# Altium schematic sheet USB_interface.SchDoc: USB interface
size 420 x 297 mm; CheckedBy: T.Janicki; CompanyName: Creotech Instruments SA; DrawnBy: G. Kasprowicz; Organization: CERN; Address1: European Organization for Nuclear Research; Address2: CH-1211 Geneve 23 - Switzerland; DocumentNumber: 10; Revision: -; SheetNumber: 17; SheetTotal: 21; EDA_Number: EDA-xxxx; Projet: Simple VME FMC Carrier; CreateDate: 20/11/2012; CheckedDate: 30/04/2012; DivGrp: BE-CO; Designer: G.Kasprowicz; DocumentName: USB.SchDoc; ModifiedDate: -; Rule: PcbType=ProtelPcb
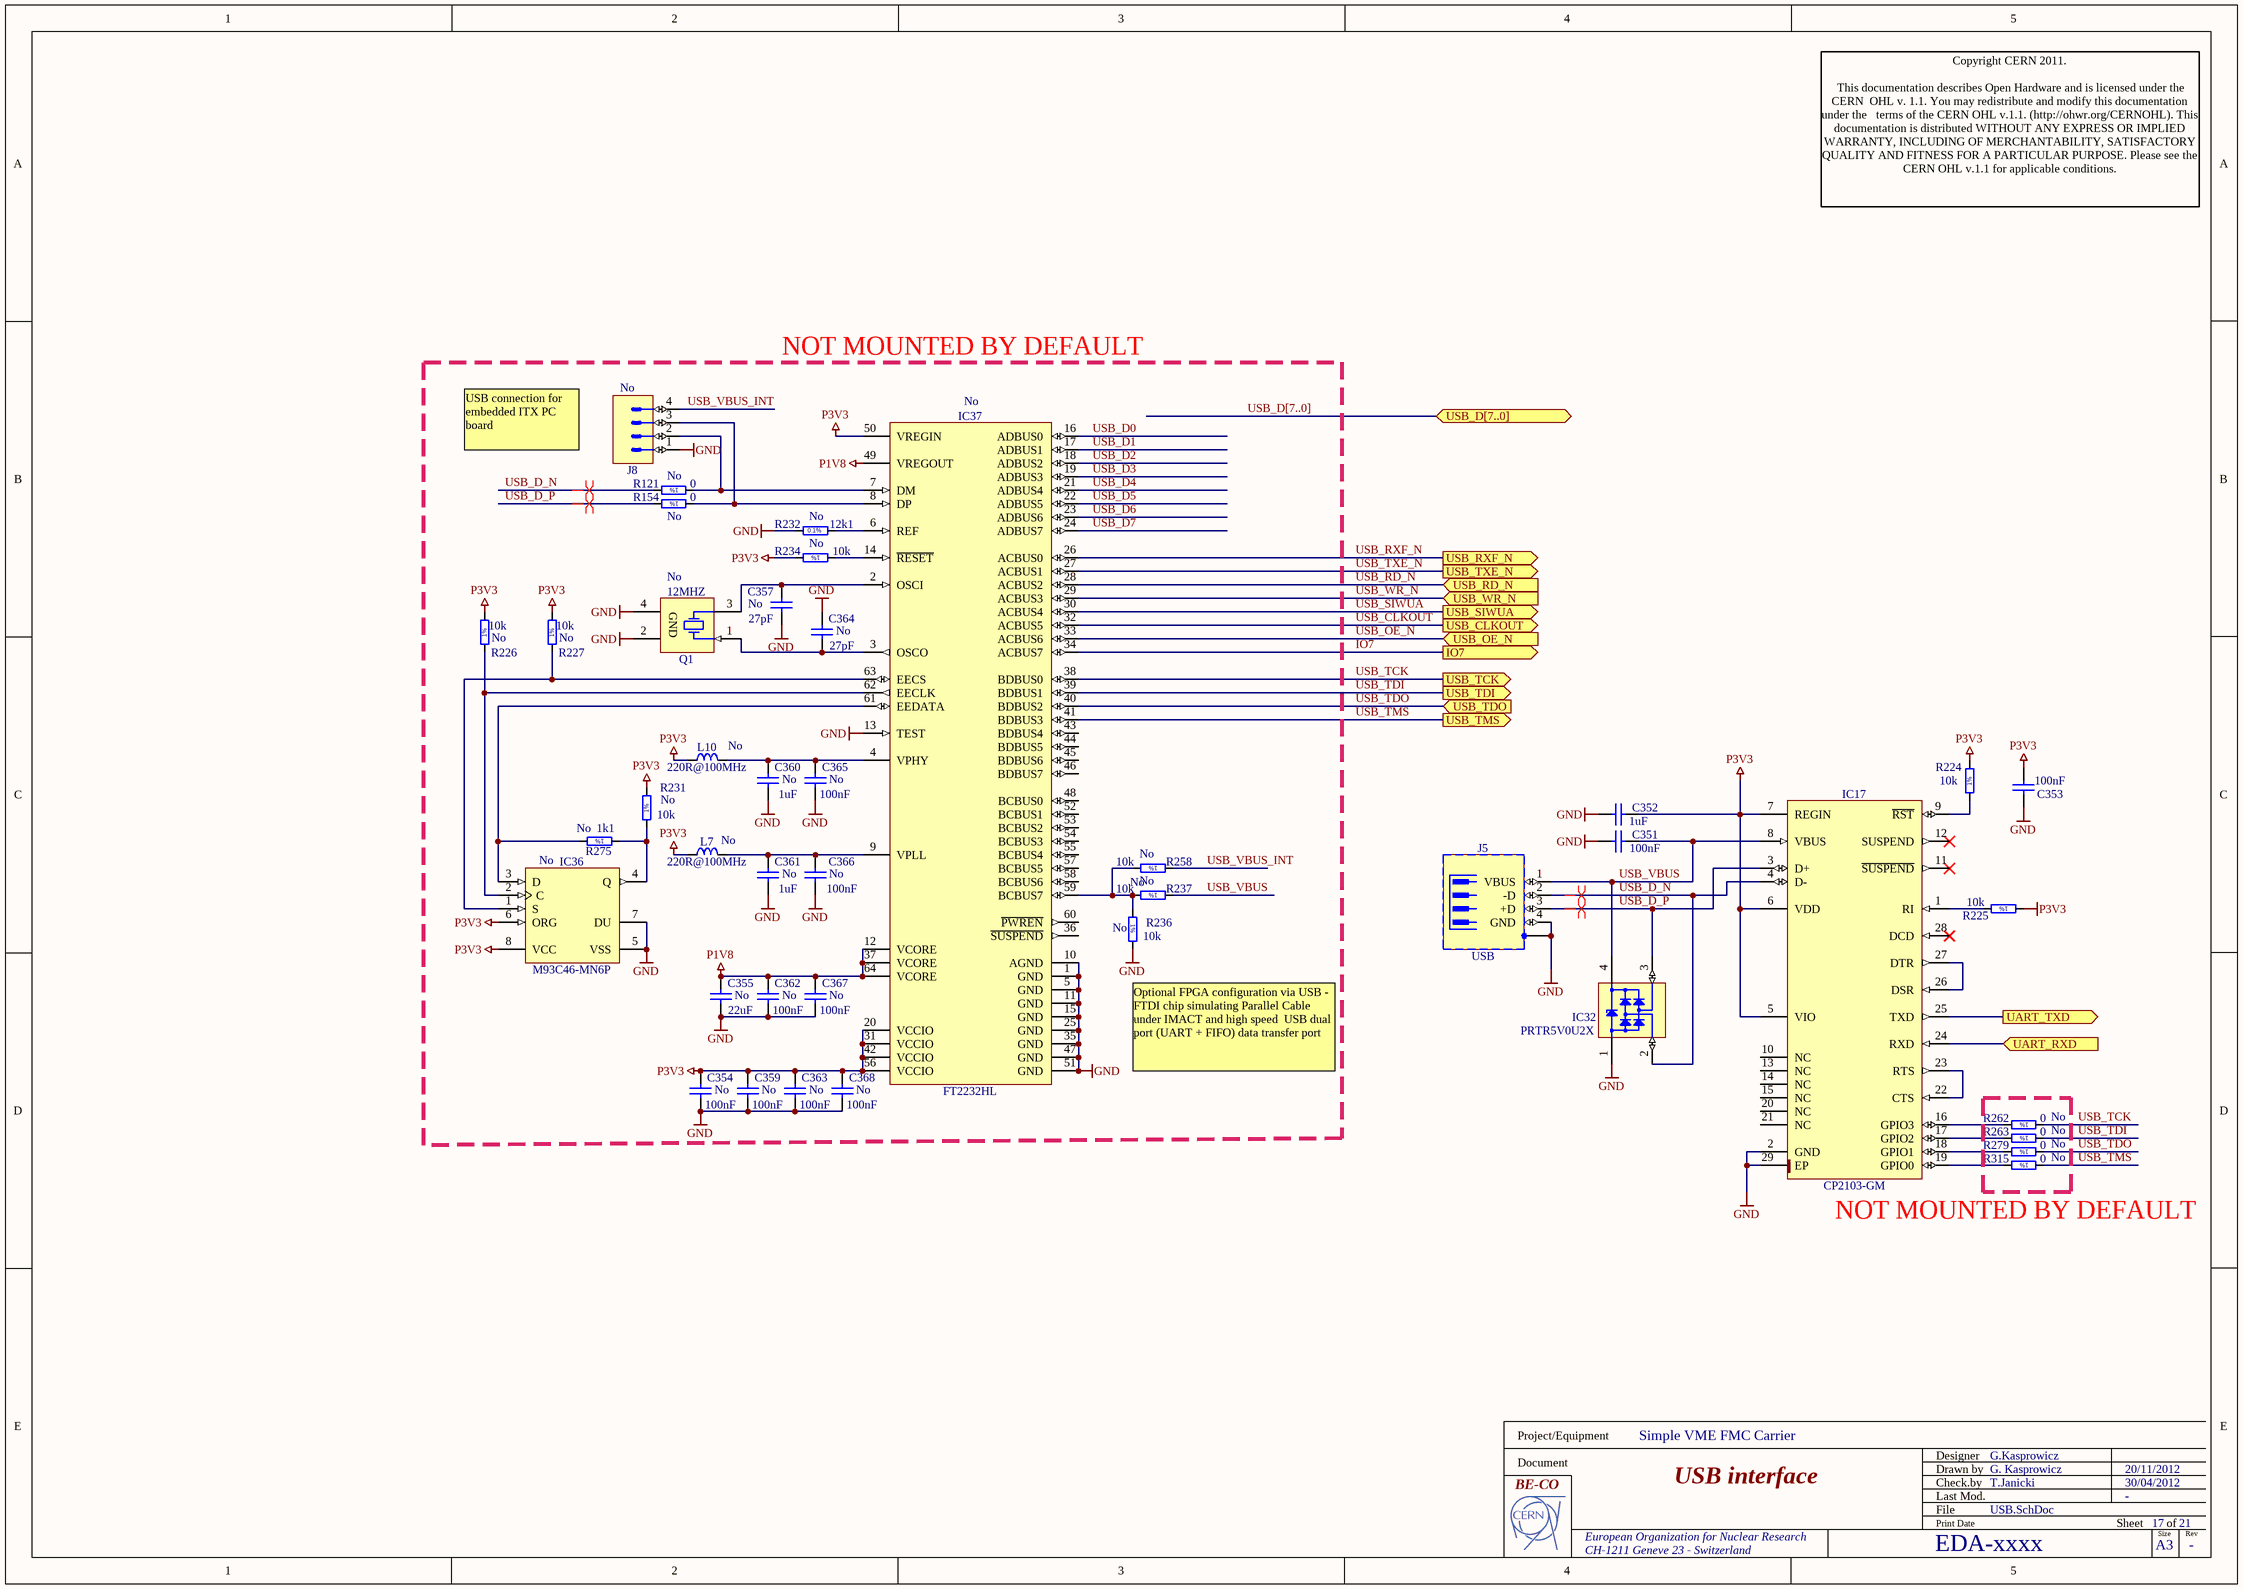
[diagram p0: USB_interface.SchDoc]

## Parts
C351  100nF  [CAPC1005X55N]
C352  1uF  [CAPC1608X87N]
C353  100nF  [CAPC1005X55N]
C354  100nF  Mounted: No  [CAPC1005X55N]
C355  22uF  Mounted: No  [CAPC3216X180N]
C357  27pF  Mounted: No  [CAPC1608X87N]
C359  100nF  Mounted: No  [CAPC1005X55N]
C360  1uF  Mounted: No  [CAPC1608X87N]
C361  1uF  Mounted: No  [CAPC1608X87N]
C362  100nF  Mounted: No  [CAPC1005X55N]
C363  100nF  Mounted: No  [CAPC1005X55N]
C364  27pF  Mounted: No  [CAPC1608X87N]
C365  100nF  Mounted: No  [CAPC1005X55N]
C366  100nF  Mounted: No  [CAPC1005X55N]
C367  100nF  Mounted: No  [CAPC1005X55N]
C368  100nF  Mounted: No  [CAPC1005X55N]
IC17  CP2103-GM  [QFN50P500X500X100-29N-S335]
IC32  PRTR5V0U2X  [SOT190P230X110-4N]
IC36  M93C46-MN6P  Mounted: No  [SOIC127P600X175-8N]
IC37  FT2232HL  Mounted: No  [QFP50P1200X1200X160-64N]
J5  USB  [TYCO_292304-1]
J8  Mounted: No  [MOLEX_22-04-1041]  (hidden comment: KK®)
L7  220R@100MHz  Mounted: No  [INDC2012X105N]
L10  220R@100MHz  Mounted: No  [INDC2012X105N]
Q1  12MHZ  Mounted: No  [XTAL_ABRACON_ABM3B]
R121  0  Mounted: No  [RESC1608X55N]
R154  0  Mounted: No  [RESC1608X55N]
R224  10k  [RESC1608X55N]
R225  10k  [RESC1608X55N]
R226  10k  Mounted: No  [RESC1608X55N]
R227  10k  Mounted: No  [RESC1608X55N]
R231  10k  Mounted: No  [RESC1608X55N]
R232  12k1  Mounted: No  [RESC1608X55N]
R234  10k  Mounted: No  [RESC1608X55N]
R236  10k  Mounted: No  [RESC1608X55N]
R237  10k  Mounted: No  Socket: No  [RESC1608X55N]
R258  10k  Mounted: No  [RESC1608X55N]
R262  0  Mounted: No  [RESC1608X55N]
R263  0  Mounted: No  [RESC1608X55N]
R275  1k1  Mounted: No  [RESC1608X55N]
R279  0  Mounted: No  [RESC1608X55N]
R315  0  Mounted: No  [RESC1608X55N]

## Blocks framed on the sheet
NOT MOUNTED BY DEFAULT: C354 C355 C357 C359-C368 IC36 IC37 J8 L7 L10 Q1 R121 R154 R226 R227 R231 R232 R234 R236 R237 R258 R275

## Ports
IO7 (out), UART_RXD (in), UART_TXD (out), USB_CLKOUT (out), USB_D[7..0] (bidir), USB_OE_N (in), USB_RD_N (in), USB_RXF_N (out), USB_SIWUA (out), USB_TCK (out), USB_TDI (out), USB_TDO (in), USB_TMS (out), USB_TXE_N (out), USB_WR_N (in)

## Nets
GND: C351.2 C352.2 C353.2 C354.2 C355.1 C357.1 C359.2 C360.1 C361.1 C362.2 C363.2 C364.1 C365.2 C366.2 C367.2 C368.2 IC17.2(GND) IC17.29(EP) IC32.1(GND) IC36.5(VSS) IC36.7(DU) IC37.1(GND) IC37.5(GND) IC37.10(AGND) IC37.11(GND) IC37.13(TEST) IC37.15(GND) IC37.25(GND) IC37.35(GND) IC37.47(GND) IC37.51(GND) J5.4(GND) J5.5(SH) J8.1 Q1.2(GND) Q1.4(GND) R232.1 R236.2
P1V8: C355.2 C362.1 C367.1 IC37.12(VCORE) IC37.37(VCORE) IC37.49(VREGOUT) IC37.64(VCORE)
P3V3: C352.1 C353.1 C354.1 C359.1 C363.1 C368.1 IC17.5(VIO) IC17.6(VDD) IC17.7(REGIN) IC36.6(ORG) IC36.8(VCC) IC37.20(VCCIO) IC37.31(VCCIO) IC37.42(VCCIO) IC37.50(VREGIN) IC37.56(VCCIO) L7.1 L10.1 R224.2 R225.1 R226.2 R227.2 R231.2 R234.2
IO7: IC37.34(ACBUS7) ; port IO7
UART_RXD: IC17.24(RXD) ; port UART_RXD
UART_TXD: IC17.25(TXD) ; port UART_TXD
USB_CLKOUT: IC37.32(ACBUS5) ; port USB_CLKOUT
USB_D0: IC37.16(ADBUS0)
USB_D1: IC37.17(ADBUS1)
USB_D2: IC37.18(ADBUS2)
USB_D3: IC37.19(ADBUS3)
USB_D4: IC37.21(ADBUS4)
USB_D5: IC37.22(ADBUS5)
USB_D6: IC37.23(ADBUS6)
USB_D7: IC37.24(ADBUS7)
USB_D_N: IC17.4(D-) IC32.2(I/O1) J5.2(-D) R121.2
USB_D_P: IC17.3(D+) IC32.3(I/O2) J5.3(+D) R154.2
USB_OE_N: IC37.33(ACBUS6) ; port USB_OE_N
USB_RD_N: IC37.28(ACBUS2) ; port USB_RD_N
USB_RXF_N: IC37.26(ACBUS0) ; port USB_RXF_N
USB_SIWUA: IC37.30(ACBUS4) ; port USB_SIWUA
USB_TCK: IC37.38(BDBUS0) R262.1 ; port USB_TCK
USB_TDI: IC37.39(BDBUS1) R263.1 ; port USB_TDI
USB_TDO: IC37.40(BDBUS2) R279.1 ; port USB_TDO
USB_TMS: IC37.41(BDBUS3) R315.1 ; port USB_TMS
USB_TXE_N: IC37.27(ACBUS1) ; port USB_TXE_N
USB_VBUS: C351.1 IC17.8(VBUS) IC32.4(VCC) J5.1(VBUS) R237.1
USB_VBUS_INT: J8.4 R258.1
USB_WR_N: IC37.29(ACBUS3) ; port USB_WR_N
NetC357_2: C357.2 IC37.2(OSCI) Q1.3(X)
NetC360_2: C360.2 C365.1 IC37.4(VPHY) L10.2
NetC361_2: C361.2 C366.1 IC37.9(VPLL) L7.2
NetC364_2: C364.2 IC37.3(OSCO) Q1.1(X)
NetIC17_1: IC17.1(RI) R225.2
NetIC17_9: IC17.9(~{RST}) R224.1
NetIC17_16: IC17.16(GPIO3) R262.2
NetIC17_17: IC17.17(GPIO2) R263.2
NetIC17_18: IC17.18(GPIO1) R279.2
NetIC17_19: IC17.19(GPIO0) R315.2
NetIC17_22: IC17.22(CTS) IC17.23(RTS)
NetIC17_26: IC17.26(DSR) IC17.27(DTR)
NetIC36_1: IC36.1(S) IC37.63(EECS) R227.1
NetIC36_2: IC36.2(C) IC37.62(EECLK) R226.1
NetIC36_3: IC36.3(D) IC37.61(EEDATA) R275.2
NetIC36_4: IC36.4(Q) R231.1 R275.1
NetIC37_6: IC37.6(REF) R232.2
NetIC37_7: IC37.7(DM) J8.2 R121.1
NetIC37_8: IC37.8(DP) J8.3 R154.1
NetIC37_14: IC37.14(~{RESET}) R234.1
NetIC37_59: IC37.59(BCBUS7) R236.1 R237.2 R258.2

Not connected (* = marked no-connect by the designer): IC17 10(NC) 11(~{SUSPEND})* 12(SUSPEND)* 13(NC) 14(NC) 15(NC) 20(NC) 21(NC) 28(DCD)*; IC37 36(~{SUSPEND}) 43(BDBUS4) 44(BDBUS5) 45(BDBUS6) 46(BDBUS7) 48(BCBUS0) 52(BCBUS1) 53(BCBUS2) 54(BCBUS3) 55(BCBUS4) 57(BCBUS5) 58(BCBUS6) 60(~{PWREN})

## Buses and harness runs
bus USB_D[7..0] = port USB_D[7..0]

## Layout directives
differential pair: USB_D_N, USB_D_P

## Notes on the sheet
- Copyright CERN 2011.
  This documentation describes Open Hardware and is licensed under the CERN  OHL v. 1.1. You may redistribute and modify this documentation under the   terms of the CERN OHL v.1.1. (http://ohwr.org/CERNOHL). This  documentation is distributed WITHOUT ANY EXPRESS OR IMPLIED  WARRANTY, INCLUDING OF MERCHANTABILITY, SATISFACTORY  QUALITY AND FITNESS FOR A PARTICULAR PURPOSE. Please see the  CERN OHL v.1.1 for applicable conditions.
- USB connection for embedded ITX PC board
- (near R236) Optional FPGA configuration via USB - FTDI chip simulating Parallel Cable under IMACT and high speed  USB dual port (UART + FIFO) data transfer port
- NOT MOUNTED BY DEFAULT
- Project/Equipment
- Document
- Designer
- Drawn by
- Check.by
- File
- Last Mod.
- Print Date
- Sheet
- Size
- A3
- of
- Rev
- (in symbol R0603_0R_JUMPER) 1%
- (in symbol R0603_1K1_1%_0.1W_100PPM) 1%
- (in symbol R0603_10K_1%_0.1W_100PPM) 1%
- (in symbol R0603_12K1_0.1%_0.063W_10PPM) 0.1%

## Library data of the parts
C351 C353 C354 C359 C362 C363 C365-C368 = CC0402_100NF_16V_10%_X7R: Non-polarised capacitor; Part Description: SMD Multilayer Chip Ceramic Capacitor; Manufacturer: GENERIC; Manufacturer1 Part Number: 223878715649; Voltage: 16V; TC: X7R; Tolerance: ±10%; Table: Capacitors SMD; Part Number: CC0402_100NF_16V_10%_X7R; Component Kind: Standard; Component Type: Standard; Pin Count: 2; Value: 100nF; Status: Not Recommended; Manufacturer Part Number: CC0402_100NF_16V_10%_X7R; Case: 0402; Socket: No; SMD: Yes; Manufacturer1 Example: PHYCOMP; Manufacturer1 ComponentHeight: 0.55mm; HelpURL: \\cern.ch\dfs\Applications\Altium\Datasheets\CC0402_X7R_PHYCOMP.pdf; Author: CERN DEM JLC; CreateDate: 03/12/2007; LatestRevisionDate: 03/12/2007
  C351 C353: Mounted: Yes
C352 C360 C361 = CC0603_1UF_16V_10%_X7R: Non-polarised capacitor; Part Description: SMD Multilayer Chip Ceramic Capacitor; Manufacturer: GENERIC; Manufacturer1 Part Number: 223824613663; Voltage: 16V; TC: X7R; Tolerance: ±10%; Table: Capacitors SMD; Part Number: CC0603_1UF_16V_10%_X7R; Component Kind: Standard; Component Type: Standard; Pin Count: 2; Value: 1uF; Status: Preferred; Manufacturer Part Number: CC0603_1uF_16V_10%_X7R; Case: 0603; Socket: No; SMD: Yes; Manufacturer1 Example: PHYCOMP; Manufacturer1 ComponentHeight: 0.87mm; HelpURL: \\cern.ch\dfs\Applications\Altium\Datasheets\CC0805_X5R_PHYCOMP_HC.pdf; Author: CERN DEM JLC
  C352: Mounted: Yes; CreateDate: 12/3/2007; LatestRevisionDate: 12/3/2007
  C360 C361: CreateDate: 03/12/2007; LatestRevisionDate: 03/12/2007
C355 = CC1206_22UF_10V_10%_X7R: Non-polarised capacitor; Part Description: SMD Multilayer Chip Ceramic Capacitor; Manufacturer: GENERIC; Manufacturer1 Part Number: GRM31CR71A226KE15L; Voltage: 10V; TC: X7R; Tolerance: ±10%; Table: Capacitors SMD; Part Number: CC1206_22UF_10V_10%_X7R; Component Kind: Standard; Component Type: Standard; Pin Count: 2; Value: 22uF; Status: Preferred; Manufacturer Part Number: CC1206_22UF_10V_10%_X7R; Case: 1206; Socket: No; SMD: Yes; Manufacturer1 Example: MURATA; Manufacturer1 ComponentHeight: 1.8mm; HelpURL: \\cern.ch\dfs\Applications\Altium\Datasheets\CC1206_X7R_MURATA_GRM-HI-CAP.pdf; Author: CERN DEM JLC; CreateDate: 2010-06-08; LatestRevisionDate: 2010-06-08
C357 C364 = CC0603_27PF_50V_5%_NP0: Non-polarised capacitor; Part Description: SMD Multilayer Chip Ceramic Capacitor; Manufacturer: GENERIC; Manufacturer1 Part Number: 223886715279; Voltage: 50V; TC: NP0; Tolerance: ±5%; Table: Capacitors SMD; Part Number: CC0603_27PF_50V_5%_NP0; Component Kind: Standard; Component Type: Standard; Pin Count: 2; Value: 27pF; Status: Preferred; Manufacturer Part Number: CC0603_27PF_50V_5%_NP0; Case: 0603; Socket: No; SMD: Yes; Manufacturer1 Example: PHYCOMP; Manufacturer1 ComponentHeight: 0.87mm; HelpURL: \\cern.ch\dfs\Applications\Altium\Datasheets\CC0603_NP0_PHYCOMP.pdf; Author: CERN DEM JLC; CreateDate: 2007-12-03; LatestRevisionDate: 2007-12-03
IC17 = CP2103-GM: Single-Chip USB to UART Bridge; Manufacturer: SILICON LABS; Table: Analog & Interface; Part Number: CP2103-GM; Component Kind: Standard; Component Type: Standard; Device: CP2103-GM; PackageDescription: QFN, 0.50mm Pitch, Square; 28 pin, 5.00mm L X 5.00mm W X 1.00mm H body (w/thermal tab 3.35 X 3.35mm),  IPC Medium Density; Part Description: Single-Chip USB to UART Bridge; Manufacturer Part Number: CP2103-GM; Pin Count: 29; Case: QFN28; Mounted: Yes; Socket: No; SMD: Yes; ComponentHeight: 1.0mm; Author: CERN DEM JLC; HelpURL: \\cern.ch\dfs\Applications\Altium\Datasheets\CP2103-GM.pdf; CreateDate: 2011-08-17; LatestRevisionDate: 2011-08-17
IC32 = PRTR5V0U2X: Ultra Low Capacitance Double Rail-to-Rail ESD Protection Diode; Part Description: Ultra Low Capacitance (1pF) Double Rail-to-Rail ESD Protection Diode (8kV); Manufacturer: PHILIPS NXP; Voltage: 5.5V; Table: Diodes; Part Number: PRTR5V0U2X; Component Kind: Standard; Component Type: Standard; Device: PRTR5V0U2X; PackageDescription: SOT143B, SOT, 1.90mm Pitch; 4 Pin, 1.30mm W X 2.90mm L X 1.10mm H body, IPC Medium Density; Manufacturer Part Number: PRTR5V0U2X; Pin Count: 4; Case: SOT143B; Mounted: Yes; Socket: No; SMD: Yes; ComponentHeight: 1.1mm; HelpURL: \\cern.ch\dfs\Applications\Altium\Datasheets\PRTR5V0U2X.pdf; Author: CERN DEM JLC; CreateDate: 3/22/2011; LatestRevisionDate: 3/22/2011
IC36 = M93C46-MN6P: 1Kb (x8/x16) Serial Microwire Bus EEPROM; Part Description: 1K (128 x 8 or 64 x 16 bit) Serial Microwire Bus EEPROM; Manufacturer: ST MICROELECTRONICS; Table: Logic; Part Number: M93C46-MN6P; Component Kind: Standard; Component Type: Standard; Device: M93C46-MN6P; PackageDescription: SOIC 8, Pitch 1.27mm - Body 4x5mm, IPC Medium Density; Manufacturer Part Number: M93C46-MN6P; Pin Count: 8; Case: SOIC8; Socket: No; SMD: Yes; ComponentHeight: 1.75mm; HelpURL: \\cern.ch\dfs\Applications\Altium\Datasheets\M93C46-MN6P.pdf; Author: CERN DEM JLC; CreateDate: 2008-09-09; LatestRevisionDate: 2008-09-09
IC37 = FT2232HL: Dual High Speed USB to Multipurpose UART/FIFO IC; Manufacturer: FUTURE TECHNOLOGY DEVICES INTERNATIONAL (FTDI); Table: Analog & Interface; Part Number: FT2232HL; Component Kind: Standard; Component Type: Standard; Device: FT2232HL; PackageDescription: QFP, 0.50mm pitch, square; 16 pin X 16 pin, 10.00mm X 10.00mm X 1.60mm Body, IPC Medium Density; Part Description: Dual High Speed USB to Multipurpose UART/FIFO IC; Manufacturer Part Number: FT2232HL; Pin Count: 64; Case: QFP64; Socket: No; SMD: Yes; ComponentHeight: 1.6mm; Author: CERN DEM JLC; HelpURL: \\cern.ch\dfs\Applications\Altium\Datasheets\FT2232HL.pdf; CreateDate: 2011-12-06; LatestRevisionDate: 2011-12-06
J5 = TYCO_292304-1: 4 Pin + 1 Shield USB Receptacle; Part Description: Thru Hole, Right Angle, 4 Position, Type B, USB Receptacle; Manufacturer: TYCO ELECTRONICS; Table: TYCO; Part Number: TYCO_292304-1; Component Kind: Standard; Component Type: Standard; Pin Count: 5; Family: USB; Mounted: Yes; Socket: No; SMD: No; Status: None; Manufacturer Part Number: 292304-1; ComponentHeight: 11.5mm; HelpURL: \\cern.ch\dfs\Applications\Altium\Datasheets\TYCO_292304-1.pdf; Author: CERN DEM JLC; CreateDate: 2010-07-16; LatestRevisionDate: 2010-07-16
J8 = MOLEX_22-04-1041: Connector 4 Male; Part Description: 2.5mm (.100") Pitch KK® Wire-to-Board Header, Vertical, with Friction Lock, 4 Circuits, Tin (Sn) Plating; Manufacturer: MOLEX; Part Number: MOLEX_22-04-1041; Component Kind: Standard; Component Type: Standard; Pin Count: 4; Family: KK®; Socket: No; SMD: No; Status: None; Manufacturer Part Number: 22-04-1041; ComponentHeight: 11.7mm; HelpURL: \\cern.ch\dfs\Applications\Altium\Datasheets\MOLEX_22-04-1041.pdf; Author: CERN DEM JLC; CreateDate: 2012-02-09; LatestRevisionDate: 2012-02-09; Table: MOLEX
L7 L10 = IND0805_MURATA_BLM21PG221SN1D: Inductor; Part Description: SMD EMIFIL Suppression Chip Bead Ferrite; Manufacturer: MURATA; Power: 2A; Resistance: 0.05R; Tolerance: ±25%; Table: Inductors SMD; Part Number: IND0805_MURATA_BLM21PG221SN1D; Component Kind: Standard; Component Type: Standard; Pin Count: 2; Value: 220R@100MHz; Status: None; Manufacturer Part Number: BLM21PG221SN1D; Case: 0805; Socket: No; SMD: Yes; ComponentHeight: 1.05mm; HelpURL: \\cern.ch\dfs\Applications\Altium\Datasheets\IND0402_MURATA_BLM21P.pdf; Author: CERN DEM JLC; CreateDate: 25/01/2010; LatestRevisionDate: 25/01/2010
Q1 = XTAL_12MHZ_ABRACON_ABM3B-12.000MHZ-B2-T: Crystal 4 pins 1=XTAL Control 2=GND3=XTAL 4=GND; Part Description: Tolerance:± 20ppm, Stability:± 50ppm, -20°C to +70°C, 18pF, Ceramic SMD Crystal, ABM3B Serie; Table: Crystals & Oscillators; Part Number: XTAL_12MHZ_ABRACON_ABM3B-12.000MHZ-B2-T; Component Kind: Standard; Component Type: Standard; PackageDescription: ABM3B Serie, SMD Cristal, Body 5.x3.2mm; Value: 12MHZ; Manufacturer: ABRACON; Manufacturer Part Number: ABM3B-12.000MHZ-B2-T; Pin Count: 2; Socket: No; SMD: Yes; ComponentHeight: 1.1mm; HelpURL: \\cern.ch\dfs\Applications\Altium\Datasheets\XTAL_ABRACON_ABM3B.pdf; Author: CERN DEM JLC; CreateDate: 2012-03-06; LatestRevisionDate: 2012-03-06
R121 R154 R262 R263 R279 R315 = R0603_0R_JUMPER: Resistor - 1%; Part Description: 1A (0.05R Max DC Resistance) Zero Ohm Jumper; Manufacturer: GENERIC; Manufacturer1 Part Number: NRC06Z0; Table: Resistors SMD; Part Number: R0603_0R_JUMPER; Component Kind: Standard; Component Type: Standard; Pin Count: 2; Value: 0; Status: Preferred; Manufacturer Part Number: R0603_0R_JUMPER; Case: 0603; Socket: No; SMD: Yes; Manufacturer1 Example: NIC COMPONENT; Manufacturer1 ComponentHeight: 0.55mm; HelpURL: \\cern.ch\dfs\Applications\Altium\Datasheets\R0603_NIC_NRC.pdf; Author: CERN DEM JLC; CreateDate: 12/3/2007; LatestRevisionDate: 3/13/2008
R224-R227 R231 R234 R236 R237 R258 = R0603_10K_1%_0.1W_100PPM: Resistor - 1%; Part Description: General Purpose Thick Film Chip Resistor; Manufacturer: GENERIC; Manufacturer1 Part Number: NRC06F1002TRF; Power: 0.1W; TC: ±100ppm/°C; Table: Resistors SMD; Part Number: R0603_10K_1%_0.1W_100PPM; Component Kind: Standard; Component Type: Standard; Pin Count: 2; Value: 10k; Status: Preferred; Tolerance: ±1%; Manufacturer Part Number: R0603_10K_1%_0.1W_100PPM; Case: 0603; SMD: Yes; Manufacturer1 Example: NIC COMPONENT; Manufacturer1 ComponentHeight: 0.55mm; HelpURL: \\cern.ch\dfs\Applications\Altium\Datasheets\R0603_NIC_NRC.pdf; Author: CERN DEM JLC; CreateDate: 12/3/2007; LatestRevisionDate: 3/13/2008
  R224 R225: Mounted: Yes; Socket: No
  R226 R227 R231 R234 R236 R258: Socket: No
R232 = R0603_12K1_0.1%_0.063W_10PPM: Resistor - 0.1%; Part Description: Thin Film Chip Resistor; Manufacturer: GENERIC; Manufacturer1 Part Number: RN73C1J12K1BTDF; Power: 0.063W; TC: ±10ppm; Table: Resistors SMD; Part Number: R0603_12K1_0.1%_0.063W_10PPM; Component Kind: Standard; Component Type: Standard; Pin Count: 2; Value: 12k1; Status: Not recommended; Tolerance: ±0.1%; Manufacturer Part Number: R0603_12K1_0.1%_0.063W_10PPM; Case: 0603; Socket: No; SMD: Yes; Manufacturer1 Example: TYCO HOLSWORTHY; Manufacturer1 ComponentHeight: 0.5mm; HelpURL: \\cern.ch\dfs\Applications\Altium\Datasheets\R0603_Tyco_RN73.pdf; Author: CERN DEM JLC; CreateDate: 2007-12-03; LatestRevisionDate: 2008-03-13
R275 = R0603_1K1_1%_0.1W_100PPM: Resistor - 1%; Part Description: General Purpose Thick Film Chip Resistor; Manufacturer: GENERIC; Manufacturer1 Part Number: NRC06F1101TRF; Power: 0.1W; TC: ±100ppm/°C; Table: Resistors SMD; Part Number: R0603_1K1_1%_0.1W_100PPM; Component Kind: Standard; Component Type: Standard; Pin Count: 2; Value: 1k1; Status: Preferred; Tolerance: ±1%; Manufacturer Part Number: R0603_1K1_1%_0.1W_100PPM; Case: 0603; Socket: No; SMD: Yes; Manufacturer1 Example: NIC COMPONENT; Manufacturer1 ComponentHeight: 0.55mm; HelpURL: \\cern.ch\dfs\Applications\Altium\Datasheets\R0603_NIC_NRC.pdf; Author: CERN DEM JLC; CreateDate: 2007-12-03; LatestRevisionDate: 2008-03-13